# Altium schematic sheet BC.SchDoc
size A4; SheetNumber: 1; SheetTotal: 2
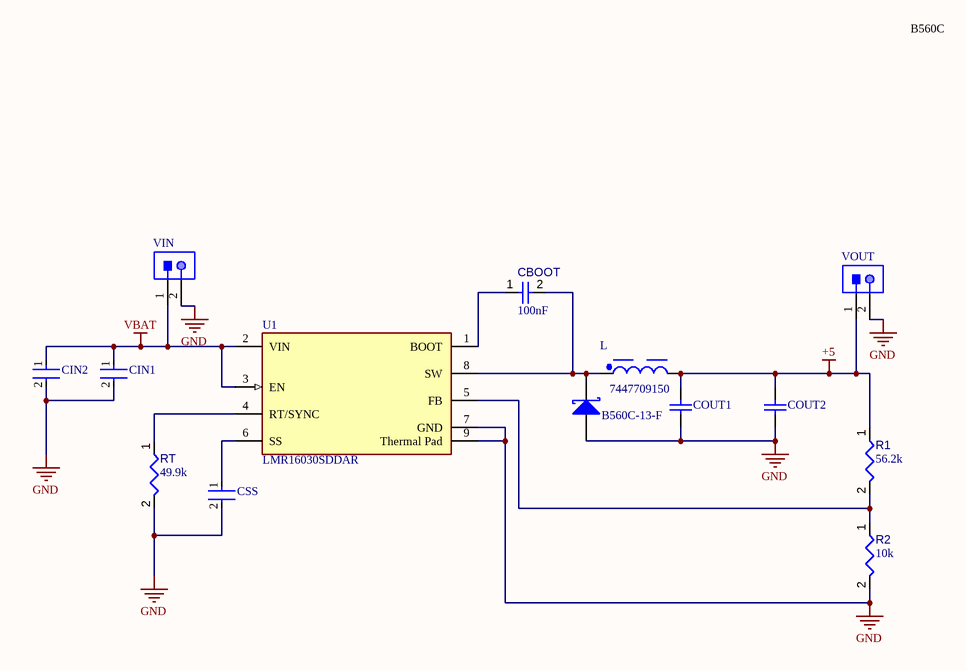
[diagram p0: BC.SchDoc]

## Parts
CBOOT  value 100nF  [CAPC1608X90X40NL10T20]  (hidden comment: Capacitor 100 nF +/-10% 50 V 0603)
CIN1  GCJ32DC72A475ME01L  [FP-GCJ32D-0_4-MFG]  (value not drawn)
CIN2  GCJ32DC72A475ME01L  [FP-GCJ32D-0_4-MFG]  (value not drawn)
COUT1  GRM32ER61C476ME15L  [MURA-1210_H_2.7_M]  (value not drawn)
COUT2  GRM32ER61C476ME15L  [MURA-1210_H_2.7_M]  (value not drawn)
CSS  CC0603KRX7R9BB223  [FP-CC0603-DA-MFG]  (value not drawn)
D  B560C-13-F  [DIOD-B5X0C-2_M]
L  7447709150  [WE-PD_1210]
R1  value 56.2k  [RESC1608X55X25ML10T15]  (hidden comment: Resistor 10k +/-1% 0603 100 mW)
R2  value 10k  [RESC1608X55X25ML10T15]  (hidden comment: Resistor 10k +/-1% 0603 100 mW)
RT  value 49.9k  [RESC1608X55X25ML10T15]  (hidden comment: Resistor 10k +/-1% 0603 100 mW)
U1  LMR16030SDDAR  [FP-DDA0008E-IPC_A]
VIN  S2B-PH-K-S(LF)(SN)  [JST-S2B-PH-K-S_V]  (value not drawn)
VOUT  S2B-PH-K-S(LF)(SN)  [JST-S2B-PH-K-S_V]  (value not drawn)

## Nets
+5: COUT1.2 COUT2.2 L.2 R1.1 VOUT.1
GND: CIN1.2 CIN2.2 COUT1.1 COUT2.1 CSS.2 D.2(A) R2.2 RT.2 U1.7(GND) U1.9(Thermal_Pad) VIN.2 VOUT.2
VBAT: CIN1.1 CIN2.1 U1.2(VIN) U1.3(EN) VIN.1
NetCBOOT_1: CBOOT.1 U1.1(BOOT)
NetCBOOT_2: CBOOT.2 D.1(K) L.1 U1.8(SW)
NetCSS_1: CSS.1 U1.6(SS)
NetR1_2: R1.2 R2.1 U1.5(FB)
NetRT_1: RT.1 U1.4(RT/SYNC)

## Notes on the sheet
- B560C

## Library data of the parts
CBOOT = CMP-001-00017-6: Chip Capacitor, 100 nF, +/- 10%, 50 V, 0603 (1608 Metric); Voltage Rating: 50V; Capacitor Type: Ceramic; Tolerance: 10%; Mounting Technology: SM; Max Operating Temperature: 125°C; RoHS Compliant: True; Pins: 2; Case/Package: 0603; Min Operating Temperature: -55°C
CIN1 CIN2 = CMP-06035-005025-1: 4.7uF ±20% 100V Ceramic Capacitor X7S 1210 (3225 Metric)
COUT1 COUT2 = CMP-2000-05260-1: CAP, Ceramic, 47 uF, 20%, 16 V, 1210, RoHS, Tape and Reel; Manufacturer: Murata; Case Length: 3.2mm; Brand: MurataElectronics; Capacitance: 47uF; Dielectric: X5R; Case Width: 2.5mm; Voltage Rating DC: 16V; Case Code - in: 1210; Datasheet Version: Aug-14; Manufacturer URL: http://www.murata.com/; Package Description: 2-Pin Surface Mount Device, Body 3.2 x 2.5 mm; Series: GRM; Minimum Operating Temperature: -55C; Package / Case: 1210(3225metric); Termination Style: SMD/SMT; Packaging: Reel; Product: GeneralTypeMLCCs; RoHS: Details; Package Reference: 1210; Case Code - mm: 3225; Datasheet URL: https://datasheet.ciiva.com/3777/2723grm32er61c476me1523-3777296.pdf; Product Category: MultilayerCeramicCapacitorsMLCC-SMD/SMT; Type: GeneralPurposeMLCC; Maximum Operating Temperature: +85C; Case Height: 2.5mm; Tolerance: 20%; Factory Pack Quantity: 1000
CSS = CMP-2100-03602-3: CAP CER 0.022UF 50V X7R 0603; Dielectric Material: Ceramic; Insulation Resistance: 100GR; Tolerance: 10%; Capacitance: 22nF; Thickness: 0.035inch; Case/Package: 0603; Packaging: Tape and Reel; Voltage Rating (DC): 50V; Length: 1.6mm; Depth: 0.8mm; Dielectric: X7R; Resistor Type: Ceramic; Min Operating Temperature: -55°C; Number of Pins: 2; Series: CC; Mount: Surface Mount; Max Operating Temperature: 125°C; Case Code (Imperial): 0603; Width: 0.031inch; Halogen Free: Halogen Free; Lead Free: Lead Free; Voltage: 50V; RoHS Compliant: Yes; Package Quantity: 1; Height: 0.8mm; REACH SVHC: No SVHC; Voltage Rating: 50V; Case Code (Metric): 1608; Termination: SMD/SMT; Radiation Hardening: No
D = CMP-2000-05098-2: Schottky Barrier Rectifier, 5 A, 60 V, -55 to 125 degC, 2-Pin SMD, RoHS, Tape and Reel; Ir - Reverse Current: 500uA; Configuration: Single; Ifsm - Forward Surge Current: 100A; Vrrm - Repetitive Reverse Voltage: 60V; Brand: DiodesIncorporated; Vf - Forward Voltage: 0.7V; If - Forward Current: 5A; Unit Weight: 0.007408oz; Type: SchottkyBarrierRectifier; Package / Case: SMC; Manufacturer URL: http://www.diodes.com/; Datasheet URL: https://datasheet.ciiva.com/27052/1538961-27052355.pdf; Factory Pack Quantity: 3000; Height: 2.5mm; Width: 6.22mm; Product Category: SchottkyDiodes&Rectifiers; Minimum Operating Temperature: -55C; Manufacturer: DiodesIncorporated; Datasheet Version: Rev. 7-2, 06/2007; Product: SchottkyDiodes; Maximum Operating Temperature: +125C; Operating Temperature Range: -55Cto+125C; Technology: Si; Length: 7.11mm; RoHS: True; Packaging: Reel; Termination Style: SMD/SMT; Series: B560; Mounting Style: SMD/SMT
L = CMP-0227-00106-3: Power Choke Shielded Wirewound 15uH 20% 1KHz Ferrite 6.5A 26mOhm DCR T/R; Inductance: 15µH; Self Resonant Frequency: 17MHz; Series Resistance: 26mΩ; Saturation Current: 8A; DC Resistance (DCR): 21mΩ; Weight: 9.071847g; Lead Free: Lead Free; Lead Pitch: 7mm; Height: 10mm; Max DC Current: 6.5A; Max Operating Temperature: 125°C; Ambient Temperature Range High: 85°C; Current Rating: 6.5A; Shielding: Shielded; Depth: 12mm; Number of Pins: 2; RMS Current (Irms): 6.5A; Test Frequency: 1kHz; Length: 12mm; Case Code (Metric): 3225; Case/Package: Nonstandard; Ambient Temperature Range Low: -40°C; Tolerance: 20%; RoHS: Compliant; Min Operating Temperature: -40°C; Core Material: Ferrite; Height - Seated (Max): 10.0076mm; Composition: Wirewound; Termination: SMD/SMT; Case Code (Imperial): 1210; Inductance Tolerance: 20%; Width: 12mm; Mount: Surface Mount
R1 R2 RT = CMP-009-00017-5: Chip Resistor, 10 KOhm, +/- 1%, 01 W, -55 to 155 degC, 0603 (1608 Metric); Voltage Rating: 50V; Power: 100mW; RoHS Compliant: True; Min Operating Temperature: -55°C; Pins: 2; Case/Package: 0603; Mounting Technology: SM; Max Operating Temperature: 155°C; Tolerance: 1%
U1 = CMP-04918-000376-1: IC REG BUCK ADJUSTABLE 3A 8SOPWR; Quiescent Current: 40uA; Lead Free: Lead Free; Max Operating Temperature: 125°C; Min Operating Temperature: -40°C; Number of Pins: 8; RoHS Compliant: Yes
VIN VOUT = CMP-002-00030-2: Male Header, Pitch 2 mm, 1 x 2 Position, Height 4.8 mm, Tail Length 3.4 mm, -25 to 85 degC, RoHS, Bulk; Manufacturer: Japan Solderless Terminals; Package Reference: S2B-PH-K-S; Case/Package: S2B-PH-K-S; Datasheet URL: http://www.jst-mfg.com/product/pdf/eng/ePH.pdf; RoHS Compliant: Unknown; Datasheet Version: Dec-12; Gender: Male; Min Operating Temperature: -25°C; Max Operating Temperature: 85°C; Package Description: Male Header, Pitch 2 mm, 1 x 2 Position, Height 4.8 mm, Tail Length 3.4 mm; Connector Type: Header; Mounting Technology: SM